# Altium schematic sheet HB100_and_neo_m6.SchDoc
size A; SheetNumber: 1; SheetTotal: 1
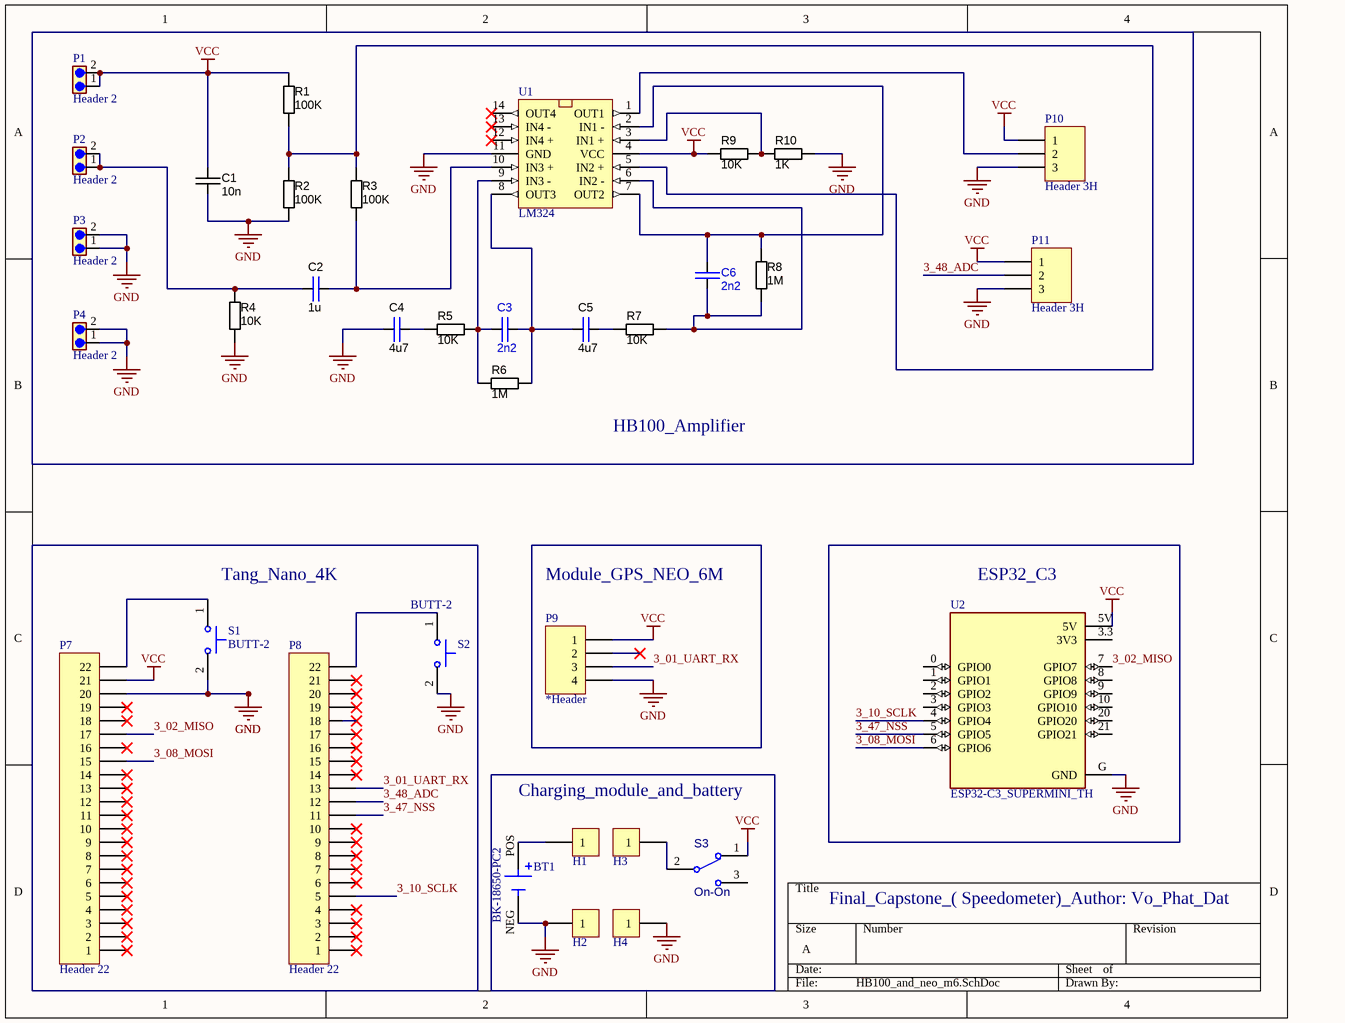
[diagram p0: HB100_and_neo_m6.SchDoc]

## Parts
BT1  BK-18650-PC2  [BAT_BK-18650-PC2]
C1  value 10n  [CAPC500P450250X550]  (hidden comment: approved sub OK)
C2  value 1u  [CAPC3216X180N]  (hidden comment: approved sub OK)
C3  value 2n2  [CAPC2012X135N]  (hidden comment: approved sub OK)
C4  value 4u7  [CAPC3216X180N]  (hidden comment: approved sub OK)
C5  value 4u7  [CAPC3216X180N]  (hidden comment: approved sub OK)
C6  value 2n2  [CAPC2012X135N]  (hidden comment: approved sub OK)
H1  Header 1  [HEAD1]  (value not drawn)
H2  Header 1  [HEAD1]  (value not drawn)
H3  Header 1  [HEAD1]  (value not drawn)
H4  Header 1  [HEAD1]  (value not drawn)
P1  Header 2  [61300211121]
P2  Header 2  [61300211121]
P3  Header 2  [61300211121]
P4  Header 2  [61300211121]
P7  Header 22  [HDR1X22]
P8  Header 22  [HDR1X22]
P9  *Header  [HDR1X4]
P10  Header 3H  [HDR1X3H]
P11  Header 3H  [HDR1X3H]
R1  value 100K  [RESC3216N_ZERO]  (hidden comment: Thick Film)
R2  value 100K  [RESC3216N_ZERO]  (hidden comment: Thick Film)
R3  value 100K  [RESC3216N_ZERO]  (hidden comment: Thick Film)
R4  value 10K  [RESC3216N_ZERO]  (hidden comment: Thick Film)
R5  value 10K  [RESC3216N_ZERO]  (hidden comment: Thick Film)
R6  value 1M  [RESC3216N_ZERO]  (hidden comment: Thick Film)
R7  value 10K  [RESC3216N_ZERO]  (hidden comment: Thick Film)
R8  value 1M  [RESC3216N_ZERO]  (hidden comment: Thick Film)
R9  value 10K  [RESC3216N_ZERO]  (hidden comment: Thick Film)
R10  value 1K  [RESC3216N_ZERO]  (hidden comment: Thick Film)
S1  BUTT-2  [SW_BUTT-2]
S2  BUTT-2  [SW_BUTT-2]
S3  ON-ON  [SWITCH_SPDT_SLIDER]
U1  LM324  [SOIC127P600X175-14N-LM324]
U2  ESP32-C3_SUPERMINI_TH  [MODULE_ESP32-C3_SUPERMINI_TH]

## Nets
GND: BT1.NEG C1.1 C4.1 H2.1 H4.1 P3.1 P3.2 P4.1 P4.2 P7.20 P9.4 P10.3 P11.3 R2.2 R4.2 R10.2 S1.2 S2.2 U1.11(GND) U2.G(GND)
VCC: C1.2 P1.1 P1.2 P7.21 P9.1 P10.1 P11.1 R1.1 R9.1 S3.1 U1.4(VCC) U2.5V
3_01_UART_RX: P8.13 P9.3
3_02_MISO: P7.17 U2.7(GPIO7)
3_08_MOSI: P7.15 U2.6(GPIO6)
3_10_SCLK: P8.5 U2.4(GPIO4)
3_47_NSS: P8.11 U2.5(GPIO5)
3_48_ADC: P8.12 P11.2
NetBT1_POS: BT1.POS H1.1
NetC2_1: C2.1 P2.1 P2.2 R4.1
NetC2_2: C2.2 R3.2 U1.10(IN3_+)
NetC3_1: C3.1 R5.2 R6.1 U1.9(IN3_-)
NetC3_2: C3.2 C5.1 R6.2 U1.8(OUT3)
NetC4_2: C4.2 R5.1
NetC5_2: C5.2 R7.1
NetC6_1: C6.1 R8.2 U1.2(IN1_-) U1.7(OUT2)
NetC6_2: C6.2 R7.2 R8.1 U1.6(IN2_-)
NetH3_1: H3.1 S3.2
NetP7_22: P7.22 S1.1
NetP8_22: P8.22 S2.1
NetP10_2: P10.2 U1.1(OUT1)
NetR1_2: R1.2 R2.1 R3.1 U1.5(IN2_+)
NetR9_2: R9.2 R10.1 U1.3(IN1_+)

Not connected (* = marked no-connect by the designer): P7 1* 2* 3* 4* 5* 6* 7* 8* 9* 10* 11* 12* 13* 14* 16* 18* 19*; P8 1* 2* 3* 4* 6* 7* 8* 9* 10* 14* 15* 16* 17* 18* 19* 20* 21*; P9 2*; S3 3; U1 12(IN4_+)* 13(IN4_-)* 14(OUT4)*; U2 0(GPIO0) 1(GPIO1) 2(GPIO2) 3(GPIO3) 3.3(3V3) 8(GPIO8) 9(GPIO9) 10(GPIO10) 20(GPIO20) 21(GPIO21)

## Notes on the sheet
- HB100_Amplifier
- (near S1) Tang_Nano_4K
- Module_GPS_NEO_6M
- (near U2) ESP32_C3
- Charging_module_and_battery
- Final_Capstone_( Speedometer)_Author: Vo_Phat_Dat

## Library data of the parts
BT1 = BK-18650-PC2: Battery Holder (Open) 18650 1 Cell PC Pin; MF: MPD (Memory; SnapEDA_Link: https://www.snapeda.com/parts/BK-18650-PC2/MPD/view-part/?ref=snap; Package: DFN-14 MPD (Memory Protection Devices); Value: *; MP: BK-18650-PC2; Check_prices: https://www.snapeda.com/parts/BK-18650-PC2/MPD/view-part/?ref=eda
C1 = CAPR_220n_Radial_5mm: Capacitor Ceramic 220nF 10% 50V X7R radial 5mm lead spacing; Manufacturer 1: TDK Corporation; Manufacturer Part Number 1: FK24X7R1H224K; Ratings: 50V; X7R; SCDType: spec; Tolerance: ±10%; Material: ceramic; Supplier 1: Digi-Key; Supplier Part Number 1: 445-2855-ND; Package / Case: 0.217" L x 0.177" W (5.50mm x 4.50mm) radial 5mm LS; Operating Temperature: -55°C ~ 125°C; ComponentLink1URL: http://www.tdk.co.jp/tefe02/e4941_fk.pdf; ComponentLink1Description: e4941_fk datasheet
C2 C4 C5 = CAP C_1206: Capacitor SMD Cer 220nF 10% 16V X7R 1206; Manufacturer 1: Murata; Manufacturer Part Number 1: GRM319R71C224KA01D; Ratings: 16V; X7R; SCDType: spec; Tolerance: ±10%; Package / Case: 1206 (3216 metric); Supplier 1: Mouser; Supplier Part Number 1: 81-GRM426X224K016D
C3 C6 = CAP C_0805: Capacitor SMD Cer 1.8nF 10% 50V X7R 0805; Manufacturer 1: AVX Corporation; Manufacturer Part Number 1: 08055C182KAT2A; Ratings: 50V; X7R; SCDType: source*; Tolerance: ±10%; Operating Temperature: -55°C ~ 125°C; Package / Case: 0805 (2012 metric); Supplier 1: Digi-Key; Supplier Part Number 1: 478-1374-1-ND
H1-H4 = Header 1: Header, 1-Pin, Right Angle; Revised: Zion Blue; Published: 6-May-2014; Publisher: Cynetik Group
P1-P4 = 6130XX11121_61300211121: MF: {'manufacturer': u'Wurth Electronics'}; Package: None; Price: None; Value: *; MP: 61300211121; Availability: Unavailable
P7 P8 = Header 22: Header, 22-Pin; LatestRevisionDate: 17-Jul-2002; LatestRevisionNote: Re-released for DXP Platform.; Publisher: Altium Limited
P9 = Header 4: Header, 4-Pin, Right Angle; LatestRevisionDate: 17-Jul-2002; LatestRevisionNote: Re-released for DXP Platform.; Publisher: Altium Limited
P10 P11 = Header 3H: Header, 3-Pin, Right Angle; LatestRevisionDate: 17-Jul-2002; LatestRevisionNote: Re-released for DXP Platform.; Publisher: Altium Limited
R1-R10 = RES_1206: Resistor SMD chip 0.0 Ohm 0.25W 1206; Manufacturer 1: Vishay/Dale; Manufacturer Part Number 1: CRCW12060000Z0EA; Tolerance: ±5%; Ratings: 1/4W; SCDType: spec*\?; Package / Case: 1206 (3216 metric); Supplier 1: Digi-Key; Supplier Part Number 1: 541-0.0ECT-ND
S1 S2 = BUTT-2: Tactile Switches MINI PUSH BUTTON SWITCH 2-PIN QTY. 4; MF: Gravitech; SnapEDA_Link: https://www.snapeda.com/parts/BUTT-2/Gravitech/view-part/?ref=snap; Package: None; Value: *; MP: BUTT-2; Check_prices: https://www.snapeda.com/parts/BUTT-2/Gravitech/view-part/?ref=eda
S3 = SW_THD_SPDT_On-On: Switch THD vertical toggle SPDT; Manufacturer 1: TE Connectivity; Manufacturer Part Number 1: SLS121PC04; Contact Rating @ Voltage: 0.25A @ 125VAC; SCDType: spec; Circuit: SPDT; Mounting Type: PCB mount; Supplier 1: Digi-Key; Supplier Part Number 1: 450-1598-ND; Switch Function: On-On
U2 = ESP32-C3_SUPERMINI_TH: Super tiny ESP32-C3 board; MF: Espressif Systems; MP: ESP32-C3 SuperMini_TH; SnapEDA_Link: https://www.snapeda.com/parts/ESP32-C3%20SuperMini_TH/Espressif+Systems/view-part/?ref=snap; Package: Package; Value: *; Check_prices: https://www.snapeda.com/parts/ESP32-C3%20SuperMini_TH/Espressif+Systems/view-part/?ref=eda